# Altium schematic sheet TCAN1146_PINOUT.SchDoc
size B; SheetNumber: 9; SheetTotal: 12
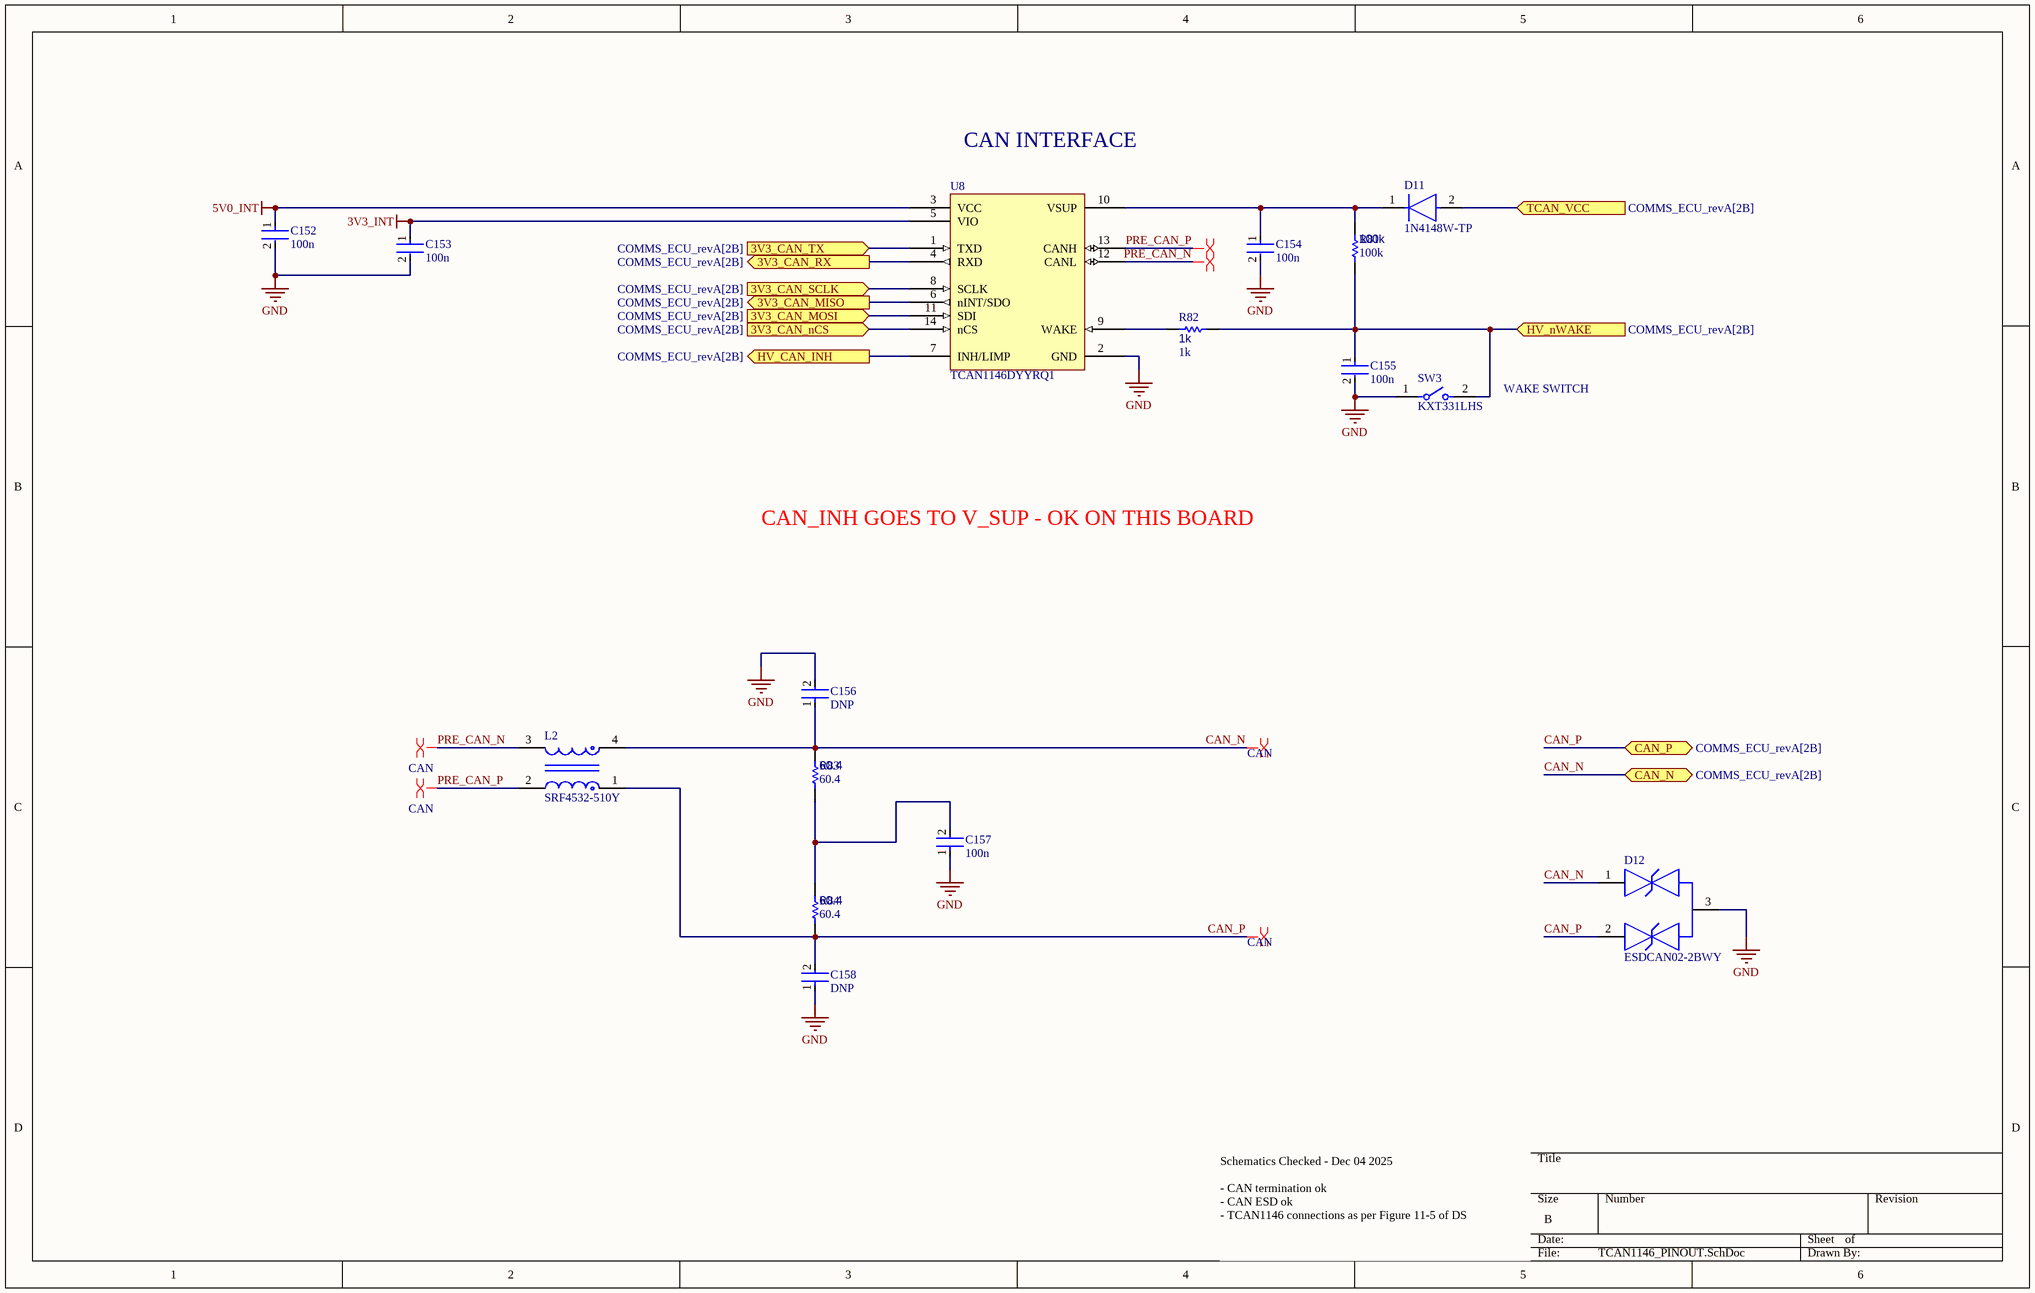
[diagram p0: TCAN1146_PINOUT.SchDoc]

## Parts
C152  100n  [FP-0402-L_1_0_0_05-W_0_5-IPC_A]
C153  100n  [FP-0402-L_1_0_0_05-W_0_5-IPC_A]
C154  100n  [FP-0402-L_1_0_0_05-W_0_5-IPC_A]
C155  100n  [FP-0402-L_1_0_0_05-W_0_5-IPC_A]
C156  DNP  [FP-0402-L_1_0_0_05-W_0_5-IPC_A]
C157  100n  [FP-0402-L_1_0_0_05-W_0_5-IPC_A]
C158  DNP  [FP-0402-L_1_0_0_05-W_0_5-IPC_A]
D11  1N4148W-TP  [FP-SOD-123-IPC_A]
D12  ESDCAN02-2BWY  [FP-SOT323-3L-MFG]
L2  SRF4532-510Y  [FP-SRF4532-MFG]
R81  100k  [R0603B]
R82  1k  [R0603B]
R83  60.4  [R0603B]
R84  60.4  [R0603B]
SW3  KXT331LHS  [FP-KXT331LHS-MFG]
U8  TCAN1146DYYRQ1  [TCAN1146DYYRQ1-Footprint-1]

## Ports
3V3_CAN_MISO (out, see COMMS_ECU_revA[2B]), 3V3_CAN_MOSI (in, see COMMS_ECU_revA[2B]), 3V3_CAN_nCS (in, see COMMS_ECU_revA[2B]), 3V3_CAN_RX (out, see COMMS_ECU_revA[2B]), 3V3_CAN_SCLK (in, see COMMS_ECU_revA[2B]), 3V3_CAN_TX (in, see COMMS_ECU_revA[2B]), CAN_N (bidir, see COMMS_ECU_revA[2B]), CAN_P (bidir, see COMMS_ECU_revA[2B]), HV_CAN_INH (out, see COMMS_ECU_revA[2B]), HV_nWAKE (in, see COMMS_ECU_revA[2B]), TCAN_VCC (in, see COMMS_ECU_revA[2B])

## Nets
3V3_INT: C153.1 U8.5(VIO)
5V0_INT: C152.1 U8.3(VCC)
GND: C152.2 C153.2 C154.2 C155.2 C156.2 C157.1 C158.1 D12.3 SW3.1 U8.2(GND)
3V3_CAN_MISO: U8.6(nINT/SDO) ; port 3V3_CAN_MISO
3V3_CAN_MOSI: U8.11(SDI) ; port 3V3_CAN_MOSI
3V3_CAN_nCS: U8.14(nCS) ; port 3V3_CAN_nCS
3V3_CAN_RX: U8.4(RXD) ; port 3V3_CAN_RX
3V3_CAN_SCLK: U8.8(SCLK) ; port 3V3_CAN_SCLK
3V3_CAN_TX: U8.1(TXD) ; port 3V3_CAN_TX
CAN_N: C156.1 D12.1 L2.4 R83.2 ; port CAN_N
CAN_P: C158.2 D12.2 L2.1 R84.1 ; port CAN_P
HV_CAN_INH: U8.7(INH/LIMP) ; port HV_CAN_INH
HV_nWAKE: C155.1 R81.1 R82.2 SW3.2 ; port HV_nWAKE
PRE_CAN_N: L2.3 U8.12(CANL)
PRE_CAN_P: L2.2 U8.13(CANH)
TCAN_VCC: D11.2(A) ; port TCAN_VCC
NetC154_1: C154.1 D11.1(C) R81.2 U8.10(VSUP)
NetC157_2: C157.2 R83.1 R84.2
NetR82_1: R82.1 U8.9(WAKE)

## Layout directives
differential pair: PRE_CAN_N, PRE_CAN_P
differential pair; differential pair class CAN: CAN_N, CAN_P, PRE_CAN_N, PRE_CAN_P

## Notes on the sheet
- CAN INTERFACE
- WAKE SWITCH
- CAN_INH GOES TO V_SUP - OK ON THIS BOARD
- Schematics Checked - Dec 04 2025
  - CAN termination ok
  - CAN ESD ok
  - TCAN1146 connections as per Figure 11-5 of DS

## Library data of the parts
C152-C158 = CMP-001-00058-1: LARGE PADS, 0402 CAP, CHANGE COMMENT TO MATCH REAL P/N; Capacitor Type: Ceramic; Min Operating Temperature: -55°C; Mounting Technology: Surface Mount; Pins: 2; Case/Package: 0402; RoHS Compliant: Yes; Max Operating Temperature: 85°C
D11 = CMP-2000-04993-2: DIODE GEN PURP 100V 150MA SOD123; Max Reverse Leakage Current: 5uA; Max Surge Current: 2A; Reverse Recovery Time: 4ns; Polarity: Standard; Capacitance: 4pF; Max Forward Surge Current (Ifsm): 1A; Element Configuration: Single; Power Dissipation: 400mW; Forward Voltage: 1V; Radiation Hardening: No; Lead Free: Lead Free; Max Reverse Voltage (DC): 100V; Current Rating: 150mA; Forward Current: 150mA; Packaging: Tape and Reel; Number of Pins: 2; Package Quantity: 3000; Max Operating Temperature: 150°C; Min Operating Temperature: -65°C; Average Rectified Current: 150mA; Recovery Time: 4ns; Output Current: 150mA; Peak Non-Repetitive Surge Current: 2A; Width: 1.8mm; Voltage Rating (DC): 100V; Height: 1.2mm; Max Repetitive Reverse Voltage (Vrrm): 100V; Mount: Surface Mount; Length: 2.85mm
D12 = CMP-12225-000055-1: TVS DIODE 26.5V 44V SOT323-3; Manufacturer: STMicroelectronics; Value: 3pF; Direction: Bidirectional; Breakdown Voltage: 28.5V; Automotive Grade: Grade 0; Standoff Height: 0mm; Peak Pulse Power: 170W; Peak Pulse Current: 3A; Number Of Channels: 2; Max Junction Temp: +175°C; Mouser Description: TVS Diodes / ESD Suppressors Automotive dual-line Transil, Transient voltage suppressor (TVS) for CAN bus; Height: 1.1mm; Category: Diode; Reverse Standoff Voltage: 26.5V; Device Class L1: Circuit Protection; Temperature: -55°C to +175°C; RoHS: TRUE; ComponentLink2URL: https://www.st.com/resource/en/datasheet/esdcan02-2bwy.pdf; Device Class L3: unset; Device Class L2: TVS Diodes; Temperature Range High: +175°C; Octopart: https://octopart.com/esdcan02-2bwy-stmicroelectronics-58631133; Ipc Land Pattern Name: SOT65P210X95-3; Temperature Range Low: -55°C; Capacitance: 3pF; Digikey Description: TVS DIODE 26.5V 44V SOT323-3; Automotive: Yes; ComponentLink2Description: Datasheet; Clamping Voltage: 44V; Manufacturer Part Number: ESDCAN02-2BWY; Lead Free: Yes; Package: SOT323-3L
L2 = CMP-07251-000006-1: CMC 51UH 200MA 2LN 2KOHM SMD; Element Configuration: Dual; Number of Lines: 2; Core Material: Ferrite; Impedance: 2kR; Test Frequency: 100kHz; Voltage Rating (DC): 50V; Insulation Resistance: 10MR; Material: Steel; Tolerance: 50%; DC Resistance (DCR): 3.5R; RoHS Compliant: Yes; Mount: Surface Mount; REACH SVHC: No SVHC; Termination: SMD/SMT; DC Current: 200mA; Current: 200mA; Lead Free: Lead Free; Contact Plating: Tin; Length: 4.5mm; Max DC Current: 200mA; Width: 0.126inch; Case/Package: 4532; Packaging: Tape and Reel; Package Quantity: 1; Min Operating Temperature: -40°C; Depth: 3.4mm; Series: SRF4532; Max Operating Temperature: 125°C; Current Rating: 200mA; Self Resonant Frequency: 100kHz; Height: 0.118inch; Inductance: 51uH; Resistance: 2kR
R81-R84 = CMP-009-00002-14: Resistor
  R81: Value: 100k
  R82: Value: 1k
  R83 R84: Value: 60.4
SW3 = CMP-10040-000029-1: SWITCH TACTILE SPST-NO 0.02A 15V; Operating Force: 240gf; Switch Travel: 0.13mm; Illumination Type: Non-Illuminated; Throw Configuration: SPST; Number of Ports: 1; Current Rating: 5A; Mechanical Life: 500000Cycles; Switch Function: Off-Mom; Connector Type: USB; Actuator Type: Standard; Gender: Receptacle; Number of Contacts: 24; Contact Plating: Gold; Insulation Color: Black; Min Operating Temperature: -40°C; Packaging: Tape and Reel; Flammability Rating: UL94 V-0; Max Operating Temperature: 85°C; Termination: Solder; Mount: Surface Mount
U8 = CMP-318-000000-2: Automotive CAN FD transceiver with watchdog, bus diagnostics and partial networking via sele 14-SOT-23-THIN -40 to 150; Component Type: Standard; Design Item ID: CMP-015-00012-2; Pin Count: 14; Source: TCAN1146DYYRQ1.SchLib